# Altium schematic sheet Debug Interface.SchDoc: Debug Interface
size Letter; SheetNumber: 10; SheetTotal: 18
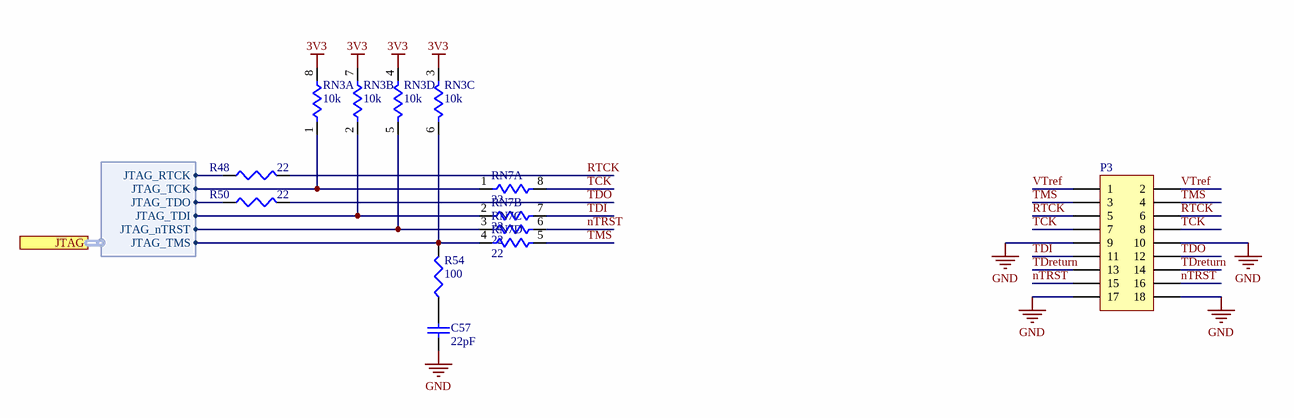
[diagram p0: Debug Interface.SchDoc]

## Parts
C57  value 22pF  [TDK-CGA2B]  (hidden comment: Cap)
P3  G125-MH11605L1  [HWN-G125-MH11605L1]  (value not drawn)
R48  value 22  [PANA-ERJ2R]  (hidden comment: Res3)
R50  value 22  [PANA-ERJ2R]  (hidden comment: Res3)
R54  value 100  [PANA-ERJ2R]  (hidden comment: Res3)
RN3  value 10k  [PANA-EXB28V]  (hidden comment: Res4 Pack1)  (parts A,B,C,D of 4)
RN7  value 22  [PANA-EXB28V]  (hidden comment: Res4 Pack1)  (parts A,B,C,D of 4)

## Ports
JTAG (harness DEBUG_JTAG)

## Harnesses
DEBUG_JTAG: JTAG_TMS, JTAG_TCK, JTAG_TDO, JTAG_TDI, JTAG_nTRST, JTAG_RTCK

## Nets
3V3: RN3.3 RN3.4 RN3.7 RN3.8
GND: C57.1 P3.9 P3.10 P3.17 P3.18
nTRST: P3.15 P3.16 RN7.6
RTCK: P3.5 P3.6 R48.1
TCK: P3.7 P3.8 RN7.8
TDI: P3.11 RN7.7
TDO: P3.12 R50.1
TDreturn: P3.13 P3.14
TMS: P3.3 P3.4 RN7.5
VTref: P3.1 P3.2
NetC57_2: C57.2 R54.1
NetR48_2: R48.2 ; port JTAG.JTAG_RTCK
NetR50_2: R50.2 ; port JTAG.JTAG_TDO
NetR54_2: R54.2 RN3.6 RN7.4 ; port JTAG.JTAG_TMS
NetRN3_1: RN3.1 RN7.1 ; port JTAG.JTAG_TCK
NetRN3_2: RN3.2 RN7.2 ; port JTAG.JTAG_TDI
NetRN3_5: RN3.5 RN7.3 ; port JTAG.JTAG_nTRST

## Notes on the sheet
- (the "License"); you may not use or redistribute this file except in compliance with the License. You
- This file and the information within it are licensed under the terms of the Apache License, Version 2.0
- Copyright
- Unless required by applicable law or agreed to in writing, content distributed under the License is
- distributed on an "AS IS" BASIS, WITHOUT WARRANTIES OR CONDITIONS OF ANY KIND,
- either express or implied. See the License for the specific language governing permissions and
- limitations under the License.
- may obtain a copy of the License at:
- http://www.apache.org/licenses/LICENSE-2.0
- Title
- Size:
- Date:
- Letter
- Number:
- Time:
- Revision:
- Sheet
- of
- University of Alberta
- Deptartment of Electrical
- and Computer Engineering
- Edmonton AB, Canada
- T6G 1H9
- File:

## Library data of the parts
C57 = PC-TDK-01149: CAP CER 22PF 50V NP0 0402; Manufacturer Part Number: CGA2B2NP01H220J050BA; Index: 1149; Designator: C?; Tolerance: ±5%; Published: 2016-03-16; LatestRevisionDate: 2016-03-16; LatestRevisionNote: ...; PackageReference: 0402 (1005 Metric); Publisher: AlbertaSat; PackageDescription: Radial Cap, Thru-Hole; 2 Leads; 0.3 in Pin Spacing; Part Number: PC-TDK-01149; Supplier Part Number 1: 445-12130-1-ND; Supplier 1: Digi-key; Supplier Link: http://www.digikey.ca/product-search/en?keywords=445-12130-1-ND; Voltage - Rated: 50V; Temperature Coefficient: NP0; Applications: Automotive
P3 = PP-HWN-00017: CONN HEADER R/A 16POS 1.25MM; Manufacturer Part Number: G125-MH11605L1P; Index: 17; Designator: P?; LatestRevisionDate: 7/8/2019; LatestRevisionNote: ...; Publisher: AlbertaSat; Part Number: PP-HWN-00017; Supplier Part Number 1: 952-2698-ND; Supplier 1: Digi-key; Supplier Part Number 2: 855-G125-MH11605L1P; Supplier 2: Mouser; Published: 7/8/2019; Supplier Link: https://www.digikey.ca/products/en?keywords=952-2698-ND
R48 R50 = 13460: RES SMD 22 OHM 1% 1/10W 0402; Part Number: 13460; Manufacturer Part Number: ERJ-2RKF22R0X; Designator: R?; Power: 0.1W, 1/10W; Temperature Coefficient: ±100ppm/°C; Published: 8-Jun-2000; LatestRevisionDate: 29-May-2009; LatestRevisionNote: IPC-7351 Footprint Added.; PackageReference: 0402 (1005 Metric); Publisher: Altium Limited; PackageDescription: Chip Resistor, 2-Leads, Body 1.00x0.50mm, IPC Low Density; Supplier Part Number 1: P22.0LCT-ND; Supplier 1: Digi-Key; Supplier Link: http://www.digikey.ca/product-search/en?keywords=P22.0LCT-ND; Tolerance: ±1%
R54 = 14081: RES SMD 100 OHM 1% 1/10W 0402; Part Number: 14081; Manufacturer Part Number: ERJ-2RKF1000X; Designator: R?; Power: 0.1W, 1/10W; Temperature Coefficient: ±100ppm/°C; Published: 8-Jun-2000; LatestRevisionDate: 29-May-2009; LatestRevisionNote: IPC-7351 Footprint Added.; PackageReference: 0402 (1005 Metric); Publisher: Altium Limited; PackageDescription: Chip Resistor, 2-Leads, Body 1.00x0.50mm, IPC Low Density; Supplier Part Number 1: P100LCT-ND; Supplier 1: Digi-Key; Supplier Link: http://www.digikey.ca/product-search/en?keywords=P100LCT-ND; Tolerance: ±1%
RN3 = 19968: RES ARRAY 4 RES 10K OHM 0804; Part Number: 19968; Manufacturer Part Number: EXB-28V103JX; Sim Note: Enter the Resistance value into parameter field.; Designator: RN?; Tolerance: ±5%; Power: 62.5mW; Temperature Coefficient: ±200ppm/°C; Code_JEDEC: MS-012-AC; Supplier Part Number 1: Y7103CT-ND; Supplier 1: Digi-Key; Supplier Link: http://www.digikey.ca/product-search/en?keywords=Y7103CT-ND; PackageReference: 0804, Convex, Long Side Terminals
RN7 = 19906: RES ARRAY 4 RES 22 OHM 0804; Part Number: 19906; Manufacturer Part Number: EXB-28V220JX; Sim Note: Enter the Resistance value into parameter field.; Designator: RN?; Tolerance: ±5%; Power: 62.5mW; Temperature Coefficient: ±200ppm/°C; Code_JEDEC: MS-012-AC; Supplier Part Number 1: Y7220CT-ND; Supplier 1: Digi-Key; Supplier Link: http://www.digikey.ca/product-search/en?keywords=Y7220CT-ND; PackageReference: 0804, Convex, Long Side Terminals